# EAGLE design Shield (EAGLE 7.2.0)
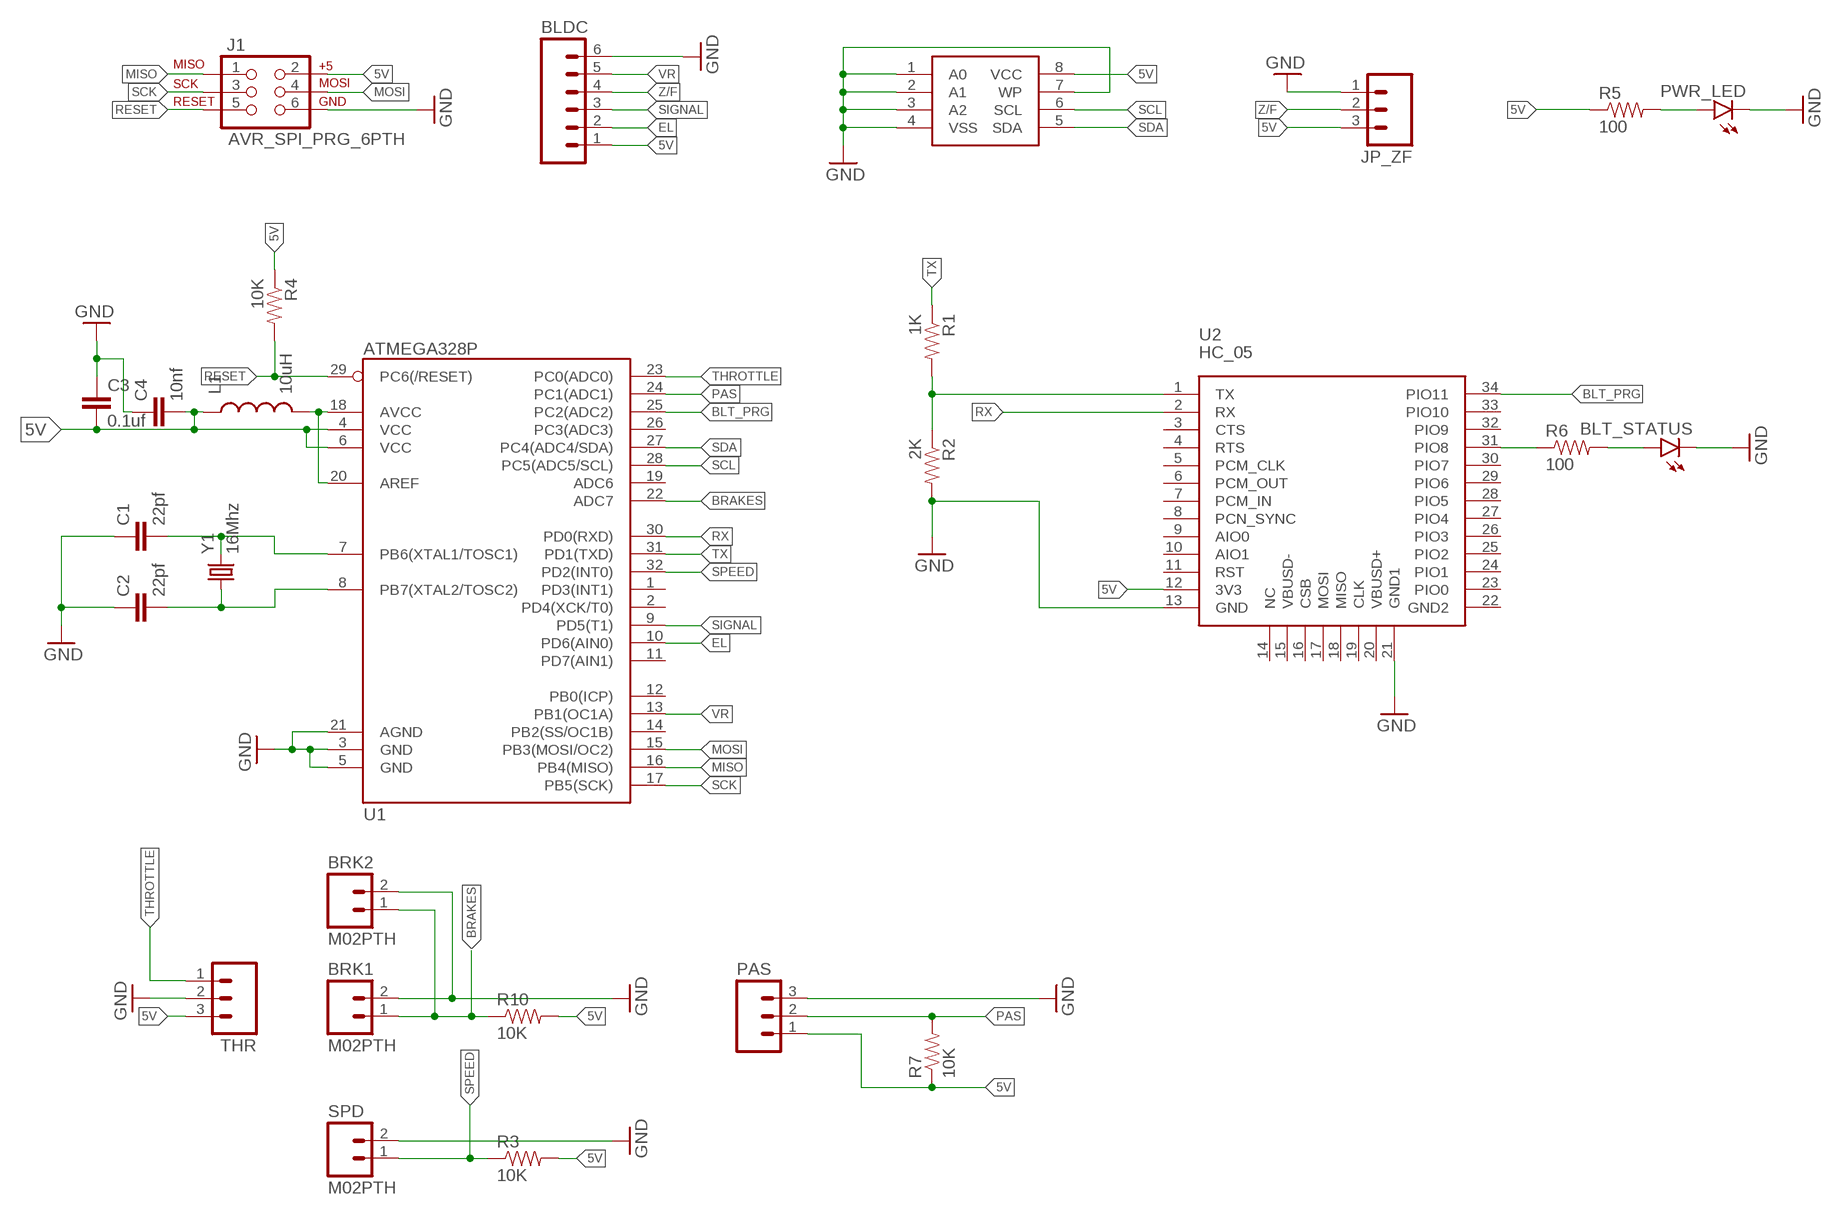
[diagram p0: schematic, sheet 1]

## Parts
BLDC  M06NO_SILK_FEMALE_PTH  [1X06_NO_SILK]
BLT_STATUS  LED1206  [LED-1206]
BRK1  M02PTH  [1X02]
BRK2  M02PTH  [1X02]
C1  22pf  CAP1206  [1206]
C2  22pf  CAP1206  [1206]
C3  0.1uf  CAP1206  [1206]
C4  10nf  CAP1206  [1206]
J1  AVR_SPI_PRG_6PTH  [2X3]
JP_ZF  M03PTH  [1X03]
L1  10uH  INDUCTOR0805  [0805]
PAS  M03PTH  [1X03]
PWR_LED  LED1206  [LED-1206]
R1  1K  RESISTOR1206  [1206]
R2  2K  RESISTOR1206  [1206]
R3  10K  RESISTOR1206  [1206]
R4  10K  RESISTOR1206  [1206]
R5  100  RESISTOR1206  [1206]
R6  100  RESISTOR1206  [1206]
R7  10K  RESISTOR1206  [1206]
R10  10K  RESISTOR1206  [1206]
SPD  M02PTH  [1X02]
THR  M03PTH  [1X03]
U1  ATMEGA328P  ATMEGA328_SMT  [TQFP32-08]
U2  HC_05  [BLUETOOTH_SMD]
U$2  24AAXXX  [SOIC-8-EIAJ]
Y1  16Mhz  CRYSTALHC49US  [HC49US]

## Nets
5V: BLDC.1 C3.2 C4.2 J1.2 JP_ZF.3 L1.1 PAS.1 R3.2 R4.1 R5.1 R7.1 R10.2 THR.3 U1.4(VCC) U1.6(VCC) U2.12(3V3) U$2.8(VCC)
BLT_PRG: U1.25(PC2(ADC2)) U2.34(PIO11)
BRAKES: BRK1.1 BRK2.1 R10.1 U1.22(ADC7)
EL: BLDC.2 U1.10(PD6(AIN0))
GND: BLDC.6 BLT_STATUS.C BRK1.2 BRK2.2 C1.1 C2.1 C3.1 C4.1 J1.6 JP_ZF.1 PAS.3 PWR_LED.C R2.2 SPD.2 THR.2 U1.3(GND) U1.5(GND) U1.21(AGND) U2.13(GND) U2.21(GND1) U$2.1(A0) U$2.2(A1) U$2.3(A2) U$2.4(VSS) U$2.7(WP)
MISO: J1.1 U1.16(PB4(MISO))
MOSI: J1.4 U1.15(PB3(MOSI/OC2))
N$1: R1.2 R2.1 U2.1(TX)
N$3: PWR_LED.A R5.2
N$4: R6.1 U2.31(PIO8)
N$5: BLT_STATUS.A R6.2
N$6: L1.2 U1.18(AVCC) U1.20(AREF)
N$15: C1.2 U1.7(PB6(XTAL1/TOSC1)) Y1.2
N$24: C2.2 U1.8(PB7(XTAL2/TOSC2)) Y1.1
PAS: PAS.2 R7.2 U1.24(PC1(ADC1))
RESET: J1.5 R4.2 U1.29(PC6(/RESET))
RX: U1.30(PD0(RXD)) U2.2(RX)
SCK: J1.3 U1.17(PB5(SCK))
SCL: U1.28(PC5(ADC5/SCL)) U$2.6(SCL)
SDA: U1.27(PC4(ADC4/SDA)) U$2.5(SDA)
SIGNAL: BLDC.3 U1.9(PD5(T1))
SPEED: R3.1 SPD.1 U1.32(PD2(INT0))
THROTTLE: THR.1 U1.23(PC0(ADC0))
TX: R1.1 U1.31(PD1(TXD))
VR: BLDC.5 U1.13(PB1(OC1A))
Z/F: BLDC.4 JP_ZF.2
Unconnected: U1.1(PD3(INT1)) U1.2(PD4(XCK/T0)) U1.11(PD7(AIN1)) U1.12(PB0(ICP)) U1.14(PB2(SS/OC1B)) U1.19(ADC6) U1.26(PC3(ADC3)) U2.3(CTS) U2.4(RTS) U2.5(PCM_CLK) U2.6(PCM_OUT) U2.7(PCM_IN) U2.8(PCN_SYNC) U2.9(AIO0) U2.10(AIO1) U2.11(RST) U2.14(NC) U2.15(VBUSD-) U2.16(CSB) U2.17(MOSI) U2.18(MISO) U2.19(CLK) U2.20(VBUSD+) U2.22(GND2) U2.23(PIO0) U2.24(PIO1) U2.25(PIO2) U2.26(PIO3) U2.27(PIO4) U2.28(PIO5) U2.29(PIO6) U2.30(PIO7) U2.32(PIO9) U2.33(PIO10)

## Library data of the parts
BLDC = SparkFun-Connectors:M06: Header 6 Standard 6-pin 0.1" header. Use with straight break away headers (SKU : PRT-00116), right angle break away headers (PRT-00553), swiss pins (PRT-00743), machine pins (PRT-00117), and female headers (PRT-00115). Molex polarized connector foot print use with SKU : PRT-08094 with associated crimp pins and housings. NOTES ON THE VARIANTS LOCK and LOCK_LONGPADS... This footprint was designed to help hold the alignment of a through-hole component (i.e. 6-pin header) while soldering it into place. You may notice that each hole has been shifted either up or down by 0.005 of an inch from it's more standard position (which is a perfectly straight line). This slight alteration caused the pins (the squares in the middle) to touch the edges of the holes. Because they are alternating, it causes a "brace" to hold the component in place. 0.005 has proven to be the perfect amount of "off-center" position when using our standard breakaway headers. Although looks a little odd when you look at the bare footprint, once you have a header in there, the alteration is very hard to notice. Also,if you push a header all the way into place, it is covered up entirely on the bottom side. This idea of altering the position of holes to aid alignment will be further integrated into the Sparkfun Library for other footprints. It can help hold any component with 3 or more connection pins.; PROD_ID: CONN-08437
BLT_STATUS PWR_LED = SparkFun-LED:LED: LEDs Standard schematic elements and footprints for 5mm, 3mm, 1206, and 0603 sized LEDs. 5mm - Spark Fun Electronics SKU : COM-00529 (and others)
BRK1 BRK2 SPD = SparkFun-Connectors:M02: Standard 2-pin 0.1" header. Use with - straight break away headers ( PRT-00116) - right angle break away headers (PRT-00553) - swiss pins (PRT-00743) - machine pins (PRT-00117) - female headers (PRT-00115) Molex polarized connector foot print use with: PRT-08233 with associated crimp pins and housings. 2.54_SCREWTERM for use with PRT-10571. 3.5mm Screw Terminal footprints for PRT-08084 5mm Screw Terminal footprints for use with PRT-08432
C1-C4 = SparkFun-Capacitors:CAP: Capacitor Standard 0603 ceramic capacitor, and 0.1" leaded capacitor.
J1 = SparkFun-Connectors:AVR_SPI_PRG_6: AVR ISP 6 Pin This is the reduced ISP connector for AVR programming. Common on Arduino. This footprint will take up less PCB space and can be used with a 10-pin to 6-pin adapter such as SKU: BOB-08508 **Special note about "TEST_POINT" package. The stop mask is on the top side, so if you want your programming test points to be on the bottom of your board, make sure to place this package on the bottom side of the board. This also ensure that the orientation to program from the bottom side will be correct.
JP_ZF PAS THR = SparkFun-Connectors:M03: Header 3 Standard 3-pin 0.1" header. Use with straight break away headers (SKU : PRT-00116), right angle break away headers (PRT-00553), swiss pins (PRT-00743), machine pins (PRT-00117), and female headers (PRT-00115). Molex polarized connector foot print use with SKU : PRT-08232 with associated crimp pins and housings.
L1 = SparkFun-Passives:INDUCTOR: Inductors Basic Inductor/Choke - 0603 and 1206. Footprints are not proven and vary greatly between part numbers. SRN6045- 33uH, 20% 1.4A SDR0403-560KL - 56uH, 10%, 500mA RMS/740mA peak
R1-R7 R10 = SparkFun-Passives:RESISTOR: Resistor Basic schematic elements and footprints for 0603, 1206, and PTH resistors.
U1 = SparkFun-DigitalIC:ATMEGA328_SMT: 32-Pin Atmega328 part Commonly used on Arduino compatible boards Available in QFP and QFN packages TQFP is IC-09069 QFN is non-stock; PROD_ID: IC-09069
U2 = Bluetooth HC-05:HC_05: HC-05 Bluetooth Module
U$2 = ucigate:24AAXXX
Y1 = SparkFun-FreqCtrl:CRYSTAL: Various standard crystals. Proven footprints. Spark Fun Electronics SKU : COM-00534

## Net classes
0 default: width 0.381 mm

## Board
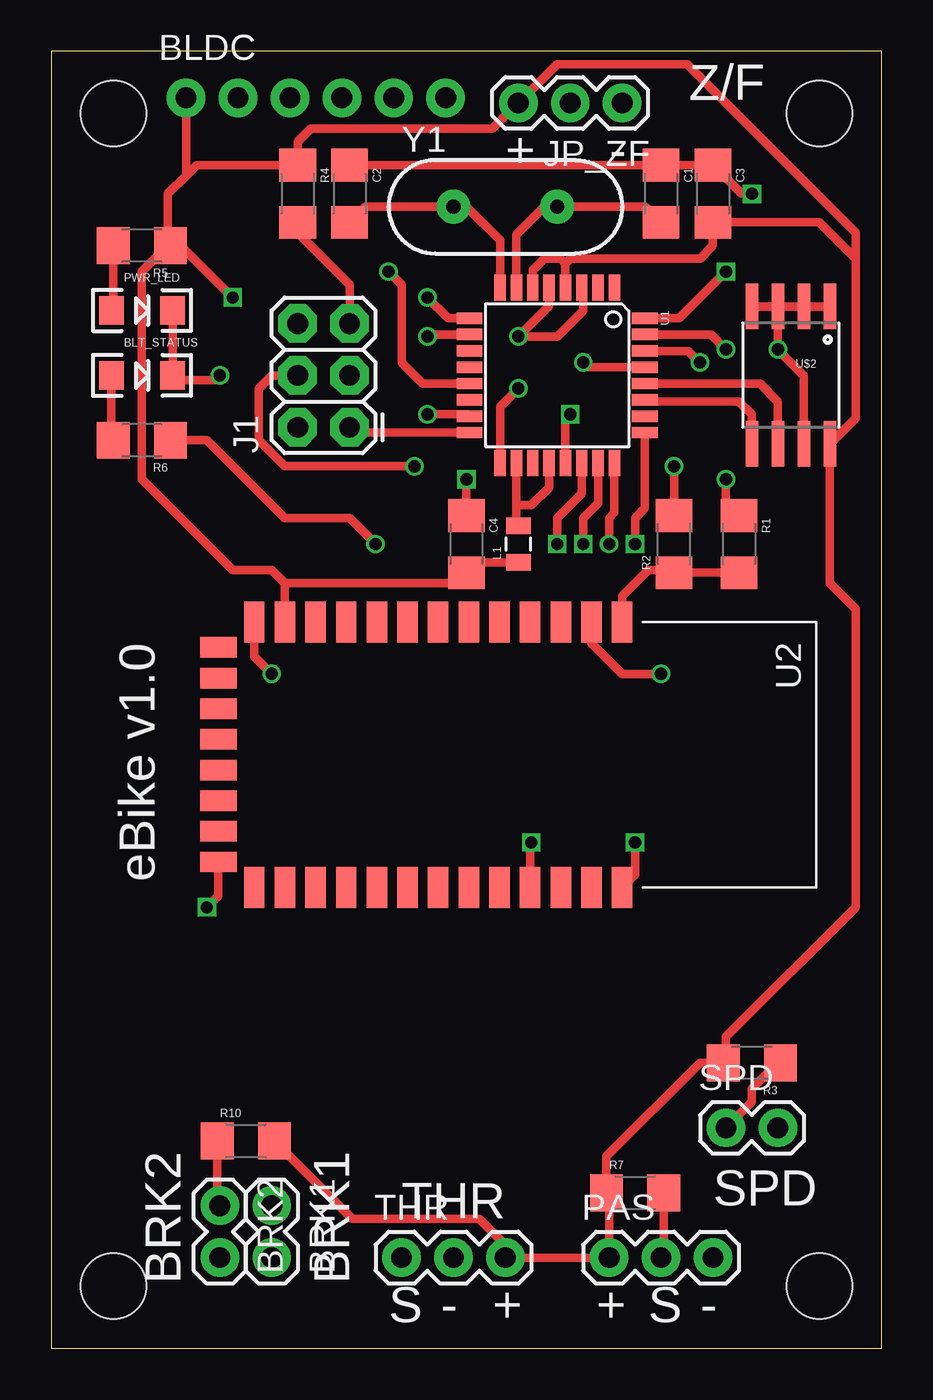
[diagram p1: board, top side]
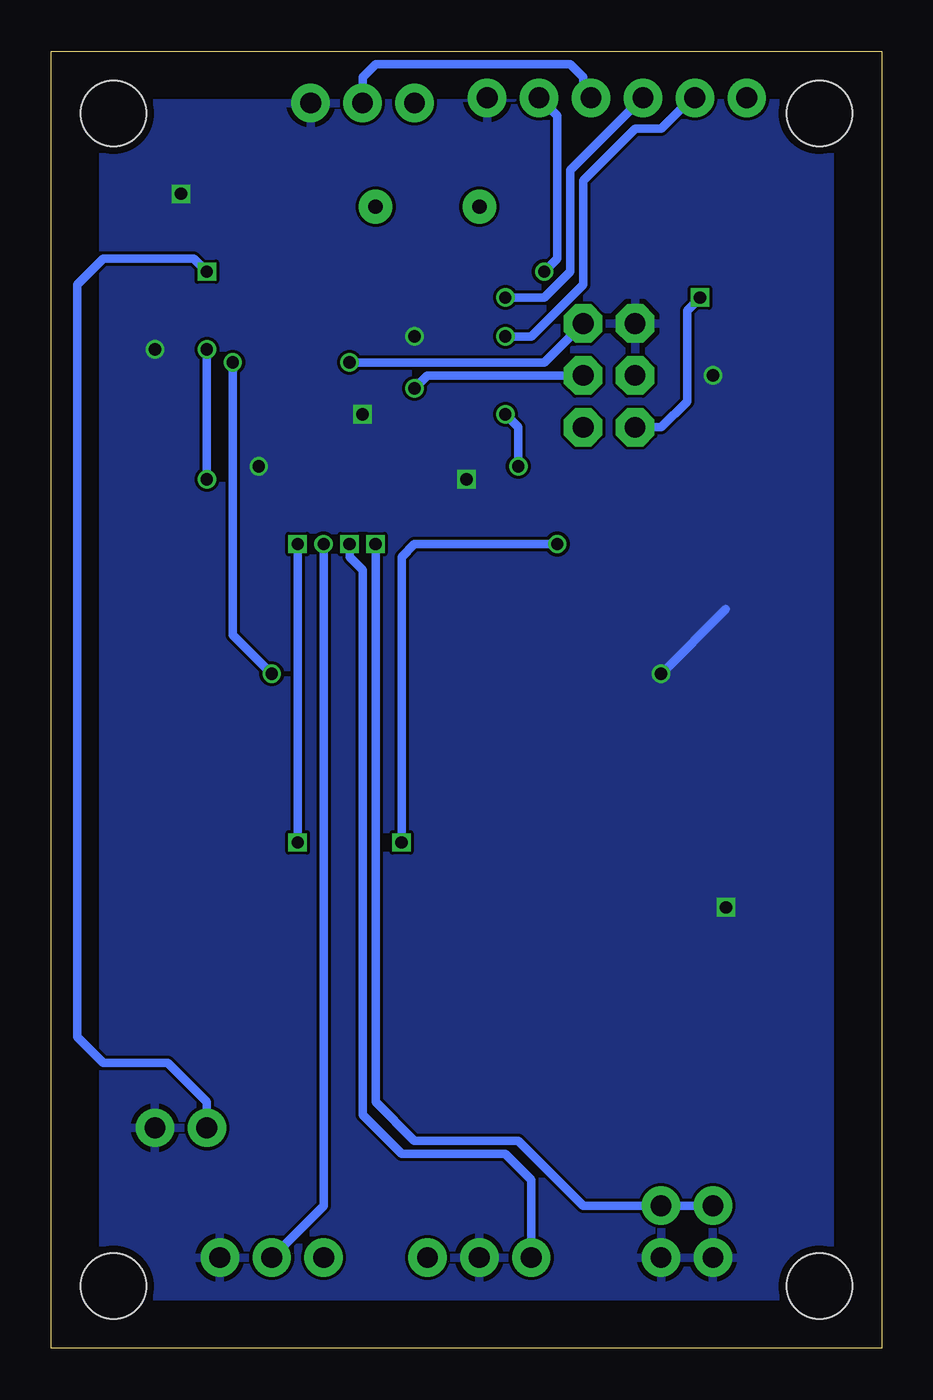
[diagram p2: board, bottom side, seen from below]

Size 40.64 x 63.5 mm. Coordinates in mm from the lower left corner, seen from the top.
Outline: 0,0 40.64,0 40.64,63.5 0,63.5 0,0
Copper layers (1*16): Top 0.035559375mm / dielectric 1.6mm / Bottom 0.035559375mm
Design rules "oshpark-2layer": minimum track width 6mil, minimum drill 10mil, track to track 6mil, track to pad 6mil, pad to pad 6mil, via to via 6mil, smd to smd 6mil, copper to edge 15mil, drill to drill 6mil, minimum pad ring 5mil, minimum via ring 5mil, stop-mask expansion 2.5mil, vias tented up to drill 0mil, thermal gap 10mil
Holes 3.2 mm at 37.59,60.45 3.05,60.45 37.59,3.05 3.05,3.05

### Footprints (pad centres in the part's own frame; a part is rotated, then mirrored left to right if it is on the bottom)
1X06_NO_SILK = drill 1.016 pad 1.88: 1 0,0; 2 2.54,0; 3 5.08,0; 4 7.62,0; 5 10.16,0; 6 12.7,0
LED-1206 = smd 1.2 x 1.4: A -1.5,0; C 1.5,0
1X02 = drill 1.016 pad 1.88: 1 0,0; 2 2.54,0
1206 = smd 1.6 x 1.8: 1 -1.4,0; 2 1.4,0
2X3 = drill 1.016 pad 1.88 octagon: 1 0,0; 2 0,2.54; 3 2.54,0; 4 2.54,2.54; 5 5.08,0; 6 5.08,2.54
1X03 = drill 1.016 pad 1.88: 1 0,0; 2 2.54,0; 3 5.08,0
0805 = smd 0.8 x 1.2: 1 -0.9,0; 2 0.9,0
TQFP32-08 = smd 1.27 x 0.559: 1 -4.293,2.8; 2 -4.293,2; 3 -4.293,1.2; 4 -4.293,0.4; 5 -4.293,-0.4; 6 -4.293,-1.2; 7 -4.293,-2; 8 -4.293,-2.8; 17 4.293,-2.8; 18 4.293,-2; 19 4.293,-1.2; 20 4.293,-0.4; 21 4.293,0.4; 22 4.293,1.2; 23 4.293,2; 24 4.293,2.8 | smd 0.559 x 1.27: 9 -2.8,-4.293; 10 -2,-4.293; 11 -1.2,-4.293; 12 -0.4,-4.293; 13 0.4,-4.293; 14 1.2,-4.293; 15 2,-4.293; 16 2.8,-4.293; 25 2.8,4.293; 26 2,4.293; 27 1.2,4.293; 28 0.4,4.293; 29 -0.4,4.293; 30 -1.2,4.293; 31 -2,4.293; 32 -2.8,4.293
BLUETOOTH_SMD = smd 2 x 1: 1 -6.35,3.81; 2 -6.35,2.31; 3 -6.35,0.81; 4 -6.35,-0.69; 5 -6.35,-2.19; 6 -6.35,-3.69; 7 -6.35,-5.19; 8 -6.35,-6.69; 9 -6.35,-8.19; 10 -6.35,-9.69; 11 -6.35,-11.19; 12 -6.35,-12.69; 13 -6.35,-14.19; 22 6.65,-14.19; 23 6.65,-12.69; 24 6.65,-11.19; 25 6.65,-9.69; 26 6.65,-8.19; 27 6.65,-6.69; 28 6.65,-5.19; 29 6.65,-3.69; 30 6.65,-2.19; 31 6.65,-0.69; 32 6.65,0.81; 33 6.65,2.31; 34 6.65,3.81 | smd 1 x 1.8: 14 -5.1,-15.94; 15 -3.6,-15.94; 16 -2.1,-15.94; 17 -0.6,-15.94; 18 0.9,-15.94; 19 2.4,-15.94; 20 3.9,-15.94; 21 5.4,-15.94
SOIC-8-EIAJ = smd 0.61 x 2.21: 1 -1.905,-3.378; 2 -0.635,-3.378; 3 0.635,-3.378; 4 1.905,-3.378; 5 1.905,3.353; 6 0.635,3.353; 7 -0.635,3.353; 8 -1.905,3.353
HC49US = drill 0.7 pad 1.651: 1 -2.54,0; 2 2.54,0

### Placement (x,y rotation side)
BLDC  6.6,61.21 0 top
BLT_STATUS  4.45,47.62 0 top
BRK1  10.79,6.99 270 top
BRK2  8.26,6.99 270 top
C1  29.84,56.52 270 top
C2  14.61,56.52 270 top
C3  32.38,56.52 270 top
C4  20.32,39.37 270 top
J1  14.61,45.09 90 top
JP_ZF  27.94,60.96 180 top
L1  22.86,39.37 90 top
PAS  27.3,4.45 0 top
PWR_LED  4.45,50.8 0 top
R1  33.66,39.37 270 top
R2  30.48,39.37 90 top
R3  34.29,13.97 180 top
R4  12.06,56.52 270 top
R5  4.45,53.98 180 top
R6  4.45,44.45 180 top
R7  28.57,7.62 0 top
R10  9.53,10.16 0 top
SPD  33.02,10.79 0 top
THR  17.14,4.45 0 top
U1  24.77,47.62 270 top
U2  24.13,29.21 270 top
U$2  36.2,47.62 180 top
Y1  22.23,55.88 0 top

### Tracks (layer width: path | path; a pad name or v marks a point on that pad's centre or on a via)
5V  (via drill 0.6)
  Top 0.406: U1.4 25.16,53.1 | 25.16,53.1 25.4,53.34 31.75,53.34 32.38,53.98 C3.2 37.59,55.12 39.37,53.34 | 6.6,57.4 7.12,57.91 R4.1 12.06,59.05 12.7,59.69 21.59,59.69 JP_ZF.3 24.77,62.87 31.11,62.87 39.37,54.61 39.37,53.34 | R5.1 5.71,54.1 5.71,56.52 6.6,57.4 | BLDC.1 6.6,57.4 | L1.1 20.82,38.47 C4.2 19.8,37.45 11.44,37.45 | U1.6 23.57,52.77 24.13,53.34 24.93,53.34 25.16,53.1 | U2.12 11.44,37.45 | R5.1 5.71,53.98 4.45,52.7 4.45,42.55 8.89,38.1 10.79,38.1 11.44,37.45 | v8.89,51.44 6.35,53.98 R5.1 | 39.37,53.34 39.37,45.54 U$2.8 38.1,37.47 39.37,36.2 39.37,21.59 33.02,15.24 33.02,14.1 R3.2 31.75,13.97 27.18,9.39 R7.1 27.3,7.49 27.3,5.08 | PAS.1 27.3,5.08 | 27.3,5.08 26.67,4.45 THR.3 22.23,5.08 20.95,6.35 14.73,6.35 R10.2
  Bottom 0.406: J1.2 10.79,45.09 9.53,46.35 9.53,50.8 v8.89,51.44
BLT_PRG  (via drill 0.6)
  Top 0.406: U1.25 29.06,41.12 28.57,40.64 v28.57,39.37 | v28.57,24.77 28.57,23.2 U2.34
  Bottom 0.406: v28.57,39.37 v28.57,24.77
BRAKES  (via drill 0.6)
  Top 0.406: U1.22 25.96,41.84 24.77,40.64 v24.77,39.37 | R10.1 8.12,7.12 BRK2.1
  Bottom 0.406: v24.77,39.37 24.77,12.06 22.86,10.16 17.78,10.16 14.61,6.99 BRK1.1 BRK2.1
EL  (via drill 0.6)
  Top 0.406: U1.10 18.51,49.62 arc90 v18.41,49.53
  Bottom 0.406: BLDC.2 9.27,61.21 10.79,59.69 12.06,59.69 14.61,57.15 14.61,52.07 17.14,49.53 v18.41,49.53
GND  (via drill 0.6)
  Top 0.406: U$2.1 U$2.2 U$2.3 | U$2.3 U$2.4 | C2.1 C1.1 C3.1 33.78,56.52 v34.29,56.52 | U$2.3 v35.56,48.9 36.83,47.62 U$2.7 | U2.13 9.94,33.88 v10.79,33.02 | R2.2 v30.48,43.18 | PWR_LED.C BLT_STATUS.C 5.71,47.4 8.03,47.4 v8.26,47.62 | U2.21 8.19,22.16 v7.62,21.59 | U1.5 24.36,51.03 v22.86,49.53 24.77,49.53 26.04,50.8 26.04,51.85 U1.3 | C4.1 v20.32,42.55 | U1.21 25.16,45.48 v25.4,45.72
  Bottom 0.406: v10.79,33.02 7.62,36.2
  pour Bottom: 2.54,60.96 2.54,2.54 38.1,2.54 38.1,60.96
MISO
  Top 0.406: U1.16 14.87,44.83 J1.1
MOSI  (via drill 0.6)
  Top 0.406: J1.4 10.79,47.62 10.16,46.99 10.16,44.45 11.43,43.18 v17.78,43.18 | U1.15 20.38,45.72 v18.41,45.72
  Bottom 0.406: v17.78,43.18 17.78,45.09 v18.41,45.72
N$1
  Top 0.406: U2.1 27.94,36.83 29.21,38.1 30.35,38.1 R2.1 R1.2
N$3
  Top 0.406: R5.2 3.04,50.9 PWR_LED.A
N$4  (via drill 0.6)
  Top 0.406: U2.31 23.44,24.71 v23.5,24.77 | R6.1 7.62,44.45 11.43,40.64 14.61,40.64 v15.88,39.37
  Bottom 0.406: v23.5,24.77 23.5,38.73 22.86,39.37 v15.88,39.37
N$5
  Top 0.406: BLT_STATUS.A 2.94,44.55 R6.2
N$6
  Top 0.406: U1.18 22.77,41.27 | 22.77,41.27 22.77,40.37 L1.2 | U1.20 24.36,42.15 23.5,41.27 22.77,41.27
N$15
  Top 0.406: U1.7 22.77,54.52 24.13,55.88 Y1.2 29.08,55.88 C1.2
N$24
  Top 0.406: C2.2 15.37,55.88 Y1.1 20.32,55.88 21.96,54.23 U1.8
PAS  (via drill 0.6)
  Top 0.406: U1.24 27.57,40.9 27.3,40.64 v27.3,39.37 | R7.2 29.98,4.58 PAS.2
  Bottom 0.406: v27.3,39.37 27.3,6.99 PAS.2
RESET  (via drill 0.6)
  Top 0.406: U1.29 26.27,48.02 v26.04,48.26 | R4.2 12.06,54.61 14.61,52.07 J1.5
  Bottom 0.406: J1.5 16.51,48.26 v26.04,48.26
RX  (via drill 0.6)
  Top 0.406: U1.30 31.18,48.83 v31.75,48.26 | v29.84,33.02 27.94,33.02 26.44,34.52 U2.2
  Bottom 0.406: v31.75,48.26 31.75,34.92 v29.84,33.02
SCK  (via drill 0.6)
  Top 0.406: U1.17 21.96,46.09 v22.86,46.99
  Bottom 0.406: J1.3 22.23,47.62 v22.86,46.99
SCL
  Top 0.406: U1.28 34.69,47.23 35.56,46.35 U$2.6
SDA
  Top 0.406: U1.27 29.13,46.35 33.66,46.35 34.29,45.72 U$2.5
SIGNAL  (via drill 0.6)
  Top 0.406: v18.41,51.44 19.43,50.42 U1.9
  Bottom 0.406: v18.41,51.44 16.51,51.44 15.24,52.7 15.24,57.66 BLDC.3
SPEED  (via drill 0.6)
  Top 0.406: v33.02,52.7 30.74,50.42 U1.32 | R3.1 35.56,13.97 34.29,12.7 34.29,12.06 SPD.1
  Bottom 0.406: SPD.1 33.02,12.06 34.92,13.97 38.1,13.97 39.37,15.24 39.37,52.07 38.1,53.34 33.66,53.34 v33.02,52.7
THROTTLE  (via drill 0.6)
  Top 0.406: U1.23 26.77,41.37 26.04,40.64 v26.04,39.37
  Bottom 0.406: v26.04,39.37 26.04,38.73 25.4,38.1 25.4,11.43 23.5,9.53 18.41,9.53 17.14,8.26 THR.1
TX  (via drill 0.6)
  Top 0.406: v33.02,42.55 33.02,41.41 R1.1 | U1.31 32.29,49.62 v33.02,48.9
  Bottom 0.406: v33.02,48.9 v33.02,42.55
VR  (via drill 0.6)
  Top 0.406: U1.13 18.18,47.23 17.14,48.26 17.14,52.07 v16.51,52.7
  Bottom 0.406: v16.51,52.7 15.88,53.34 15.88,60.33 BLDC.5
Z/F
  Bottom 0.406: JP_ZF.2 25.4,62.23 24.77,62.87 15.24,62.87 14.61,62.23 14.61,61.59 BLDC.4

### Text on the board
tPlace: Z/F | + | - | eBike v1.0 | SPD | THR | BRK2 | BRK1 | S | - | + | + | S | -